# Altium schematic sheet FT232BL.SchDoc
size A4
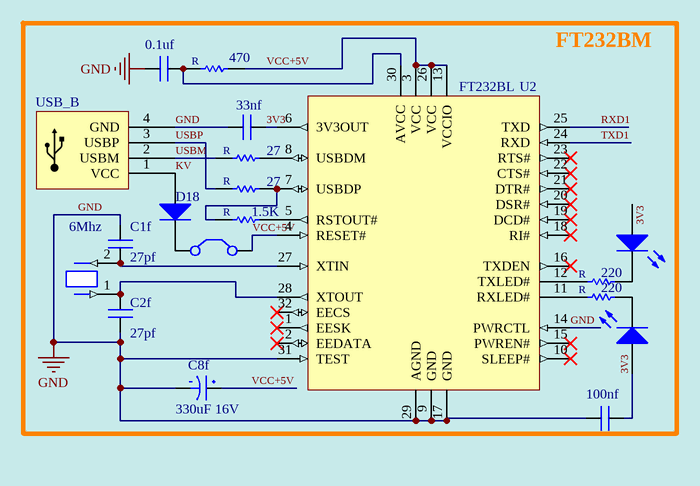
[diagram p0: FT232BL.SchDoc]

## Parts
6  1.5K  [R0805]
9f  LED_SMD  [Led0805]  (value not drawn)
278D  470  [R0805]
C1f  27pf  [Cap0805]
C2f  27pf  [Cap0805]
C3f  0.1uf  [Cap0805]
C4AED  100nf  [Cap0805]
C6f  33nf  [Cap0805]
C8f  Cap_4mm  [2220]  (value not drawn)
D18  (no value)  [Diod-1A-SMD]
fdcg3W7  Jumper  [Jumper]  (value not drawn)
fff  LED_SMD  [Led0805]  (value not drawn)
RF5  27  [R0805]
RF6  27  [R0805]
RF7  220  [R0805]
RF8  220  [R0805]
U2  FT232BL  [LQFP-32_N]
USBE  USB_B  [USB/SM2.5-4H4A]
Y2fD  6Mhz  [Crystal]

## Blocks framed on the sheet
FT232BM: 6 9f 278D C1f C2f C3f C4AED C6f C8f D18 fdcg3W7 fff RF5-RF8 U2 USBE Y2fD

## Nets
GND: C1f.2 C2f.1 C3f.1 C4AED.2 C6f.1 C8f.1 U2.9(GND) U2.14(PWRCTL) U2.17(GND) U2.29(AGND) U2.31(TEST) USBE.4(GND)
3V3: 9f.A C4AED.1 C6f.2 fff.A U2.6(3V3OUT)
KV: D18.A USBE.1(VCC)
RXD1: U2.25(TXD)
TXD1: U2.24(RXD)
USBM: RF5.2 USBE.2(USBM)
USBP: RF6.2 USBE.3(USBP)
VCC+5V: 278D.1 C8f.2 fdcg3W7.2(C2) U2.3(VCC) U2.4(RESET#) U2.13(VCCIO) U2.26(VCC)
Net6_1: 6.1 U2.5(RSTOUT#)
Net6_2: 6.2 RF6.1 U2.7(USBDP)
Net9f_K: 9f.K RF7.1
Net278D_2: 278D.2 C3f.2 U2.30(AVCC)
NetC1f_1: C1f.1 U2.27(XTIN) Y2fD.2
NetC2f_2: C2f.2 U2.28(XTOUT) Y2fD.1
NetD18_K: D18.K fdcg3W7.1(C1)
Netfff_K: fff.K RF8.1
NetRF5_1: RF5.1 U2.8(USBDM)
NetRF7_2: RF7.2 U2.12(TXLED#)
NetRF8_2: RF8.2 U2.11(RXLED#)

Not connected (* = marked no-connect by the designer): U2 1(EESK)* 2(EEDATA)* 10(SLEEP#)* 15(PWREN#)* 16(TXDEN)* 18(RI#)* 19(DCD#)* 20(DSR#)* 21(DTR#)* 22(CTS#)* 23(RTS#)* 32(EECS)*

## Notes on the sheet
- Title
- Size:
- Data:
- CompanyName:
- A4
- Number:
- Time:
- Revision:
- Engineer:
- File:
- (in symbol Cap_4mm) 330uF 16V
- (in symbol R0805) R

## Library data of the parts
6 278D RF5-RF8 = R0805
C1f C2f C3f C4AED C6f = Cap0805: surface mount capacitor (size 805)
D18 = Diode 1N4001 SMD
U2 = FT232BL: USB UART Asynchronous Serial Data Transfer Chip, 0 to +70 degC, 32-pin LQFP, Pb-Free; Manufacturer: FTDI; DatasheetVersion: ver 2.2, Nov-2011; PackageVersion: Nov-11; PackageReference: LQFP-32; PackageDescription: 32-Pin Thin Quad Flat Pack, 7 x 7 mm Body, 0.8 mm Pitch; PartNumber: FT232BL; ComponentLink1Description: Manufacturer URL; ComponentLink1URL: http://www.ftdichip.com/; ComponentLink2Description: Datasheet; ComponentLink2URL: http://www.ftdichip.com/Support/Documents/DataSheets/ICs/DS_FT232BL_BQ.pdf
Y2fD = Crystal